# EAGLE schematic outdoor (EAGLE 7.1.2)
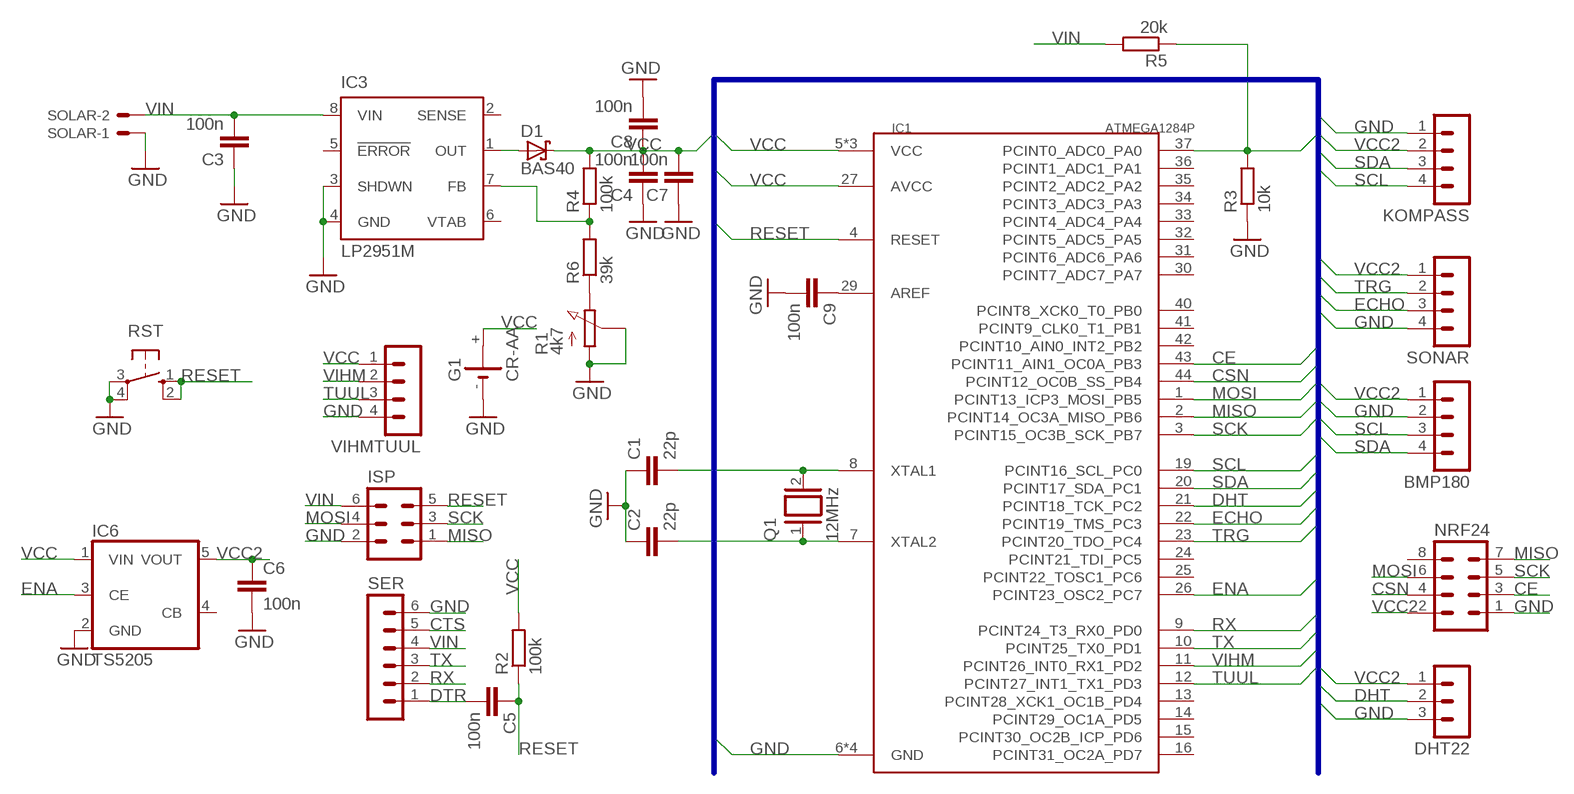
[diagram p0: schematic, sheet 1]

## Parts
BMP180  MA04-1  [MA04-1]
C1  22p  C-EUC1206K  [C1206K]
C2  22p  C-EUC1206K  [C1206K]
C3  100n  C-EUC1206K  [C1206K]
C4  100n  C-EUC1206K  [C1206K]
C5  100n  C-EUC1206K  [C1206K]
C6  100n  C-EUC1206K  [C1206K]
C7  100n  C-EUC1206K  [C1206K]
C8  100n  C-EUC1206K  [C1206K]
C9  100n  C-EUC1206K  [C1206K]
D1  BAS40  [SOT23]
DHT22  MA03-1  [MA03-1]
G1  CR-AA  [CRAA]
IC1  ATMEGA1284P  [TQFP44]
IC3  LP2951M  [SO08]
IC6  TS5205  [SOT25]
ISP  MA03-2  [MA03-2]
KOMPASS  MA04-1  [MA04-1]
NRF24  MA04-2  [MA04-2]
Q1  12MHz  XTAL/S  [QS]
R1  4k7  PC25  [PC25]
R2  100k  R-EU_M1206  [M1206]
R3  10k  R-EU_M1206  [M1206]
R4  100k  R-EU_M1206  [M1206]
R5  20k  R-EU_M1206  [M1206]
R6  39k  R-EU_M1206  [M1206]
RST  10-XX  [B3F-10XX]
SER  MA06-1  [MA06-1]
SOLAR  22-23-2021  [22-23-2021]
SONAR  MA04-1  [MA04-1]
VIHMTUUL  MA04-1  [MA04-1]

## Nets
B$1: IC1.37(PCINT0_ADC0_PA0) R3.2 R5.1
CE: IC1.43(PCINT11_AIN1_OC0A_PB3) NRF24.3
CSN: IC1.44(PCINT12_OC0B_SS_PB4) NRF24.4
CTS: SER.5
DHT: DHT22.2 IC1.21(PCINT18_TCK_PC2)
DTR: C5.2 SER.1
ECHO: IC1.22(PCINT19_TMS_PC3) SONAR.3
ENA: IC1.26(PCINT23_OSC2_PC7) IC6.3(CE)
GND: BMP180.2 C1.1 C2.1 C3.1 C4.1 C6.2 C7.1 C8.2 C9.2 DHT22.3 G1.- IC1.6(GND) IC1.18(GND) IC1.28(GND) IC1.39(GND) IC3.3(SHDWN) IC3.4(GND) IC6.2(GND) ISP.2 KOMPASS.1 NRF24.1 R1.A R1.S R3.1 RST.3(P) RST.4(P1) SER.6 SOLAR.1 SONAR.4 VIHMTUUL.4
MISO: IC1.2(PCINT14_OC3A_MISO_PB6) ISP.1 NRF24.7
MOSI: IC1.1(PCINT13_ICP3_MOSI_PB5) ISP.4 NRF24.6
N$1: C1.2 IC1.8(XTAL1) Q1.2
N$2: C2.2 IC1.7(XTAL2) Q1.1
N$3: R1.E R6.1
N$4: D1.1(A) IC3.1(OUT)
N$5: IC3.7(FB) R4.1 R6.2
N$6: C9.1 IC1.29(AREF)
RESET: C5.1 IC1.4(RESET) ISP.5 R2.1 RST.1(S) RST.2(S1)
RX: IC1.9(PCINT24_T3_RX0_PD0) SER.2
SCK: IC1.3(PCINT15_OC3B_SCK_PB7) ISP.3 NRF24.5
SCL: BMP180.3 IC1.19(PCINT16_SCL_PC0) KOMPASS.4
SDA: BMP180.4 IC1.20(PCINT17_SDA_PC1) KOMPASS.3
TRG: IC1.23(PCINT20_TDO_PC4) SONAR.2
TUUL: IC1.12(PCINT27_INT1_TX1_PD3) VIHMTUUL.3
TX: IC1.10(PCINT25_TX0_PD1) SER.3
VCC: C4.2 C7.2 C8.1 D1.3(C) G1.+ IC1.5(VCC) IC1.17(VCC) IC1.27(AVCC) IC1.38(VCC) IC6.1(VIN) R2.2 R4.2 VIHMTUUL.1
VCC2: BMP180.1 C6.1 DHT22.1 IC6.5(VOUT) KOMPASS.2 NRF24.2 SONAR.1
VIHM: IC1.11(PCINT26_INT0_RX1_PD2) VIHMTUUL.2
VIN: C3.2 IC3.8(VIN) ISP.6 R5.2 SER.4 SOLAR.2
Unconnected: G1.+@1(+) IC1.13(PCINT28_XCK1_OC1B_PD4) IC1.14(PCINT29_OC1A_PD5) IC1.15(PCINT30_OC2B_ICP_PD6) IC1.16(PCINT31_OC2A_PD7) IC1.24(PCINT21_TDI_PC5) IC1.25(PCINT22_TOSC1_PC6) IC1.30(PCINT7_ADC7_PA7) IC1.31(PCINT6_ADC6_PA6) IC1.32(PCINT5_ADC5_PA5) IC1.33(PCINT4_ADC4_PA4) IC1.34(PCINT3_ADC3_PA3) IC1.35(PCINT2_ADC2_PA2) IC1.36(PCINT1_ADC1_PA1) IC1.40(PCINT8_XCK0_T0_PB0) IC1.41(PCINT9_CLK0_T1_PB1) IC1.42(PCINT10_AIN0_INT2_PB2) IC3.2(SENSE) IC3.5(!ERROR) IC3.6(VTAB) IC6.4(CB) NRF24.8

## Buses
B$1

## Library data of the parts
BMP180 KOMPASS SONAR VIHMTUUL = con-lstb:MA04-1: PIN HEADER; OC_FARNELL: unknown; OC_NEWARK: unknown
C1-C9 = rcl:C-EU: CAPACITOR, European symbol
D1 = diode:BAS40: Silicon Schottky Diodes General-purpose diode for high-speed switching
DHT22 = con-lstb:MA03-1: PIN HEADER; OC_FARNELL: unknown; OC_NEWARK: unknown
G1 = battery:CR-AA: LI BATTERY Varta CRAA-SLF
IC1 = Stephanie_Parts:ATMEGA1284P: My version schematic & footprint for the ATMega1284P TQFP-44 package. Matches digikey part ATMEGA1284P-AU-ND. Tested & working.
IC3 = national-semiconductor:LP2951: Adjustable Micropower Voltage Regulator Source: http://www.national.com/ds/LP/LP2950.pdf; MF: FAIRCHILD SEMICONDUCTOR; MPN: LP2951CM; OC_FARNELL: 9488561; OC_NEWARK: 78K6014
IC6 = v-reg:TS5205: 150mA Low Noise LDO Voltage Regulator with Enable TSC [Taiwan Semiconductor Company, Ltd] Source: http://www.taiwansemi.com .. 5205_0409c.pdf
ISP = con-lstb:MA03-2: PIN HEADER; OC_FARNELL: unknown; OC_NEWARK: unknown
NRF24 = con-lstb:MA04-2: PIN HEADER; OC_FARNELL: unknown; OC_NEWARK: unknown
Q1 = special:XTAL/S: CRYSTAL
R1 = pot-vitrohm:PC25: VITROHM POTENTIOMETER; MF: CLAROSTAT; MPN: 308NPC25KS; OC_FARNELL: 1440998; OC_NEWARK: 03F7518
R2-R6 = rcl:R-EU_: RESISTOR, European symbol
RST = switch-omron:10-XX: OMRON SWITCH; MPN: B3F-1000; OC_FARNELL: 176432; OC_NEWARK: 36M3542
SER = con-lstb:MA06-1: PIN HEADER; OC_FARNELL: unknown; OC_NEWARK: unknown
SOLAR = con-molex:22-23-2021: .100" (2.54mm) Center Header - 2 Pin; MF: MOLEX; MPN: 22-23-2021; OC_FARNELL: 1462926; OC_NEWARK: 25C3832